# EAGLE schematic thingSocketv0.2 (EAGLE 7.7.0)
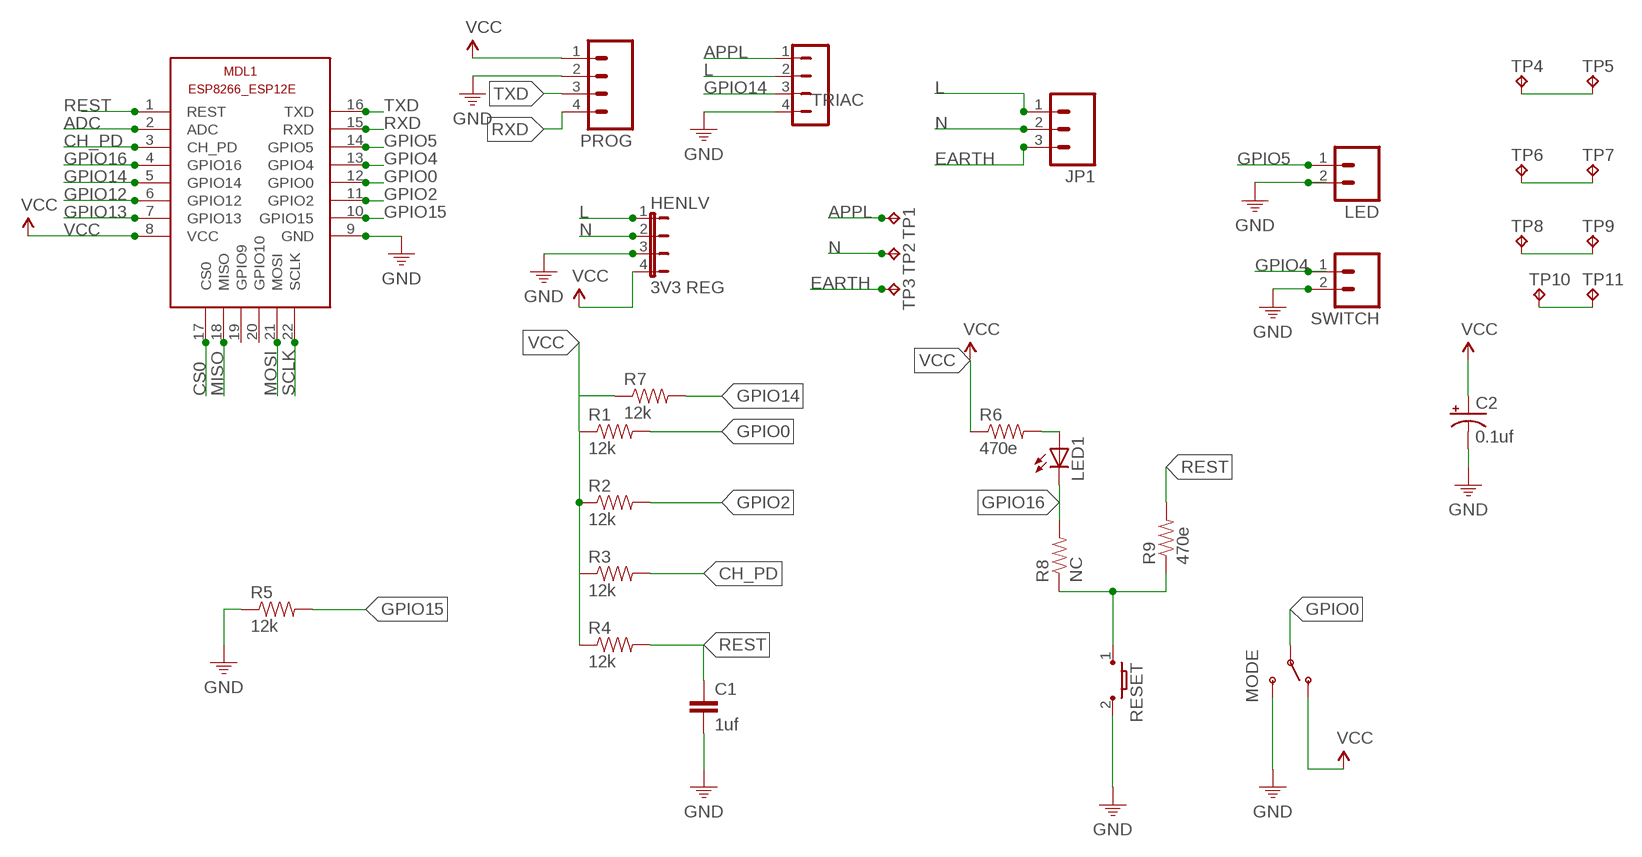
[diagram p0: schematic, sheet 1]

## Parts
C1  1uf  CAP0603-CAP  [0603-CAP]
C2  0.1uf  CAP_POLSMD  [VISHAY_C]
HENLV  3V3 REG  HENLV3.3  [HENLV3.3PKG]
JP1  M03SCREW  [SCREWTERMINAL-3.5MM-3]
LED  M02  [02P]
LED1  LEDCHIPLED_0805  [CHIPLED_0805]
MDL1  ESP8266-12EESP8266-ESP12E  [ESP8266-ESP12E]
MODE  SWITCH-SPSTSMD2  [SWITCH-SPDT-SMD]
PROG  M04-V  [OUPIIN-4071V-4]
R1  12k  RESISTOR0603-RES  [0603-RES]
R2  12k  RESISTOR0603-RES  [0603-RES]
R3  12k  RESISTOR0603-RES  [0603-RES]
R4  12k  RESISTOR0603-RES  [0603-RES]
R5  12k  RESISTOR0603-RES  [0603-RES]
R6  470e  RESISTOR0603-RES  [0603-RES]
R7  12k  RESISTOR0603-RES  [0603-RES]
R8  NC  RESISTOR0603-RES  [0603-RES]
R9  470e  RESISTOR0603-RES  [0603-RES]
RESET  TL3302-J  [TL3303_J]
SWITCH  M02  [02P]
TP1  TPPAD1-17  [P1-17]
TP2  TPPAD1-17  [P1-17]
TP3  TPPAD1-17  [P1-17]
TP4  TP-040  [TP-040]
TP5  TP-040  [TP-040]
TP6  TP-040  [TP-040]
TP7  TP-040  [TP-040]
TP8  TP-040  [TP-040]
TP9  TP-040  [TP-040]
TP10  TP-040  [TP-040]
TP11  TP-040  [TP-040]
TRIAC  JP2Q  [JP2Q]

## Nets
ADC: MDL1.2(ADC)
APPL: TP1.1(TP) TRIAC.1
CH_PD: MDL1.3(CH_PD) R3.2
CS0: MDL1.17(CS0)
EARTH: JP1.3 TP3.1(TP)
GND: C1.2 C2.- HENLV.3 LED.2 MDL1.9(GND) MODE.3(S) R5.1 RESET.2 SWITCH.2 TRIAC.4
GPIO0: MDL1.12(GPIO0) MODE.2(P) R1.2
GPIO2: MDL1.11(GPIO2) R2.2
GPIO4: MDL1.13(GPIO4) SWITCH.1
GPIO5: LED.1 MDL1.14(GPIO5)
GPIO12: MDL1.6(GPIO12)
GPIO13: MDL1.7(GPIO13)
GPIO14: MDL1.5(GPIO14) R7.2 TRIAC.3
GPIO15: MDL1.10(GPIO15) R5.2
GPIO16: LED1.C MDL1.4(GPIO16) R8.2
L: HENLV.1 JP1.1 TRIAC.2
MISO: MDL1.18(MISO)
MOSI: MDL1.21(MOSI)
N: HENLV.2 JP1.2 TP2.1(TP)
N$1: TP4.1 TP5.1
N$2: TP6.1 TP7.1
N$4: R8.1 R9.1 RESET.1
N$6: TP8.1 TP9.1
N$7: TP10.1 TP11.1
N$14: LED1.A R6.2
REST: C1.1 MDL1.1(REST) R4.2 R9.2
RXD: MDL1.15(RXD) PROG.4
SCLK: MDL1.22(SCLK)
TXD: MDL1.16(TXD) PROG.2 PROG.3 ; supply symbol labelled GND
VCC: C2.+ HENLV.4 MDL1.8(VCC) MODE.1(O) PROG.1 R1.1 R2.1 R3.1 R4.1 R6.1 R7.1
Unconnected: MDL1.19(GPIO9) MDL1.20(GPIO10)

## Library data of the parts
C1 = SparkFun:CAP: Capacitor Standard 0603 ceramic capacitor, and 0.1" leaded capacitor.
C2 = SparkFun-Capacitors:CAP_POL: Capacitor Polarized These are standard SMD and PTH capacitors. Normally 10uF, 47uF, and 100uF in electrolytic and tantalum varieties. Always verify the external diameter of the through hole cap, it varies with capacity, voltage, and manufacturer. The EIA devices should be standard.
HENLV = jumper111:HENLV3.3: JUMPER
JP1 = SparkFun:M03: Header 3 Standard 3-pin 0.1" header. Use with straight break away headers (SKU : PRT-00116), right angle break away headers (PRT-00553), swiss pins (PRT-00743), machine pins (PRT-00117), and female headers (PRT-00115). Molex polarized connector foot print use with SKU : PRT-08232 with associated crimp pins and housings.
LED SWITCH = tango:M02: AMP QUICK CONNECTOR
LED1 = adafruit:LED: LED OSRAM: - CHIPLED LG R971, LG N971, LY N971, LG Q971, LY Q971, LO R971, LY R971 LH N974, LH R974 LS Q976, LO Q976, LY Q976 LO Q996 - Hyper CHIPLED LW Q18S LB Q993, LB Q99A, LB R99A - SideLED LS A670, LO A670, LY A670, LG A670, LP A670 LB A673, LV A673, LT A673, LW A673 LH A674 LY A675 LS A676, LA A676, LO A676, LY A676, LW A676 LS A679, LY A679, LG A679 - Hyper Micro SIDELED® LS Y876, LA Y876, LO Y876, LY Y876 LT Y87S - SmartLED LW L88C, LW L88S LB L89C, LB L89S, LG L890 LS L89K, LO L89K, LY L89K LS L896, LA L896, LO L896, LY L896 - TOPLED LS T670, LO T670, LY T670, LG T670, LP T670 LSG T670, LSP T670, LSY T670, LOP T670, LYG T670 LG T671, LOG T671, LSG T671 LB T673, LV T673, LT T673, LW T673 LH T674 LS T676, LA T676, LO T676, LY T676, LB T676, LH T676, LSB T676, LW T676 LB T67C, LV T67C, LT T67C, LS T67K, LO T67K, LY T67K, LW E67C LS E67B, LA E67B, LO E67B, LY E67B, LB E67C, LV E67C, LT E67C LW T67C LS T679, LY T679, LG T679 LS T770, LO T770, LY T770, LG T770, LP T770 LB T773, LV T773, LT T773, LW T773 LH T774 LS E675, LA E675, LY E675, LS T675 LS T776, LA T776, LO T776, LY T776, LB T776 LHGB T686 LT T68C, LB T68C - Hyper Mini TOPLED® LB M676 - Mini TOPLED Santana® LG M470 LS M47K, LO M47K, LY M47K Source: http://www.osram.convergy.de/
MDL1 = ESP8266-ESP12E:ESP8266-12E: ESP8266-12E with additional I/O and GPIO04/05 corrected The author cannot warrant that this library is free from error or will meet your specific requirements. Created by PuceBaboon.com. Komagane, Nagano, JAPAN
MODE = SparkFun:SWITCH-SPST: SPST Switch Simple slide switch. Spark Fun Electronics SKU : COM-00102
PROG = con-oupiin:M04: Oupiin 4071 Series: 4 Pin Male Standard 4-pin 0.1" header. -V: Standard vertical. Supplier: Altronics P5494 -V-LOCK: Vertical with slightly offset pin drills for easier hand soldering (SparkFun trick) Supplier: Altronics P5494 Source: http://www.oupiin.com.tw/pdf/4071-W.pdf
R1-R9 = SparkFun:RESISTOR: Resistor Basic schematic elements and footprints for 0603, 1206, and PTH 1/10th watt (small) resistors.
RESET = eswitch-tact:TL3302: E-Switch TL3302 Series Tactile Switch Surface mount button commonly used for reset or general input. 3.5 x 6mm packaged design. -G: Gull wing termination. Parts TL-3302-x-xxxx-x-G -J: J-Lead termination. Parts TL-3302-x-xxxx-x-J Source: http://www.e-switch.com/Portals/0/Series_Pdf/TL3302.pdf Supplier: DigiKey: http://be.digikey.com/scripts/dksearch/dksus.dll?vendor=0&keywords=TL3302
TP1-TP3 = testpad:TP: Test pad
TP4-TP11 = keystone:TP: TEST POINT PCB Vertical Mount
TRIAC = pwm-base:JP2Q: JUMPER

## Net classes
0 default: width 0.254 mm, drill 0.2 mm, clearance 0.254 mm
1 pwr: width 0.508 mm, drill 0.2 mm, clearance 0.205 mm to class 0, clearance 0.254 mm